# EasyEDA Pro project pad_2025-11-01.epro

# Schematic pad
Board Name: pad; Create Date: 2025-10-30; Page Name: Sheet_1; Project Name: Makro; Schematic Name: pad; Update Date: 2025-10-30; Add into BOM: yes; Convert to PCB: yes; Sheet: 1/1; spicePre: .
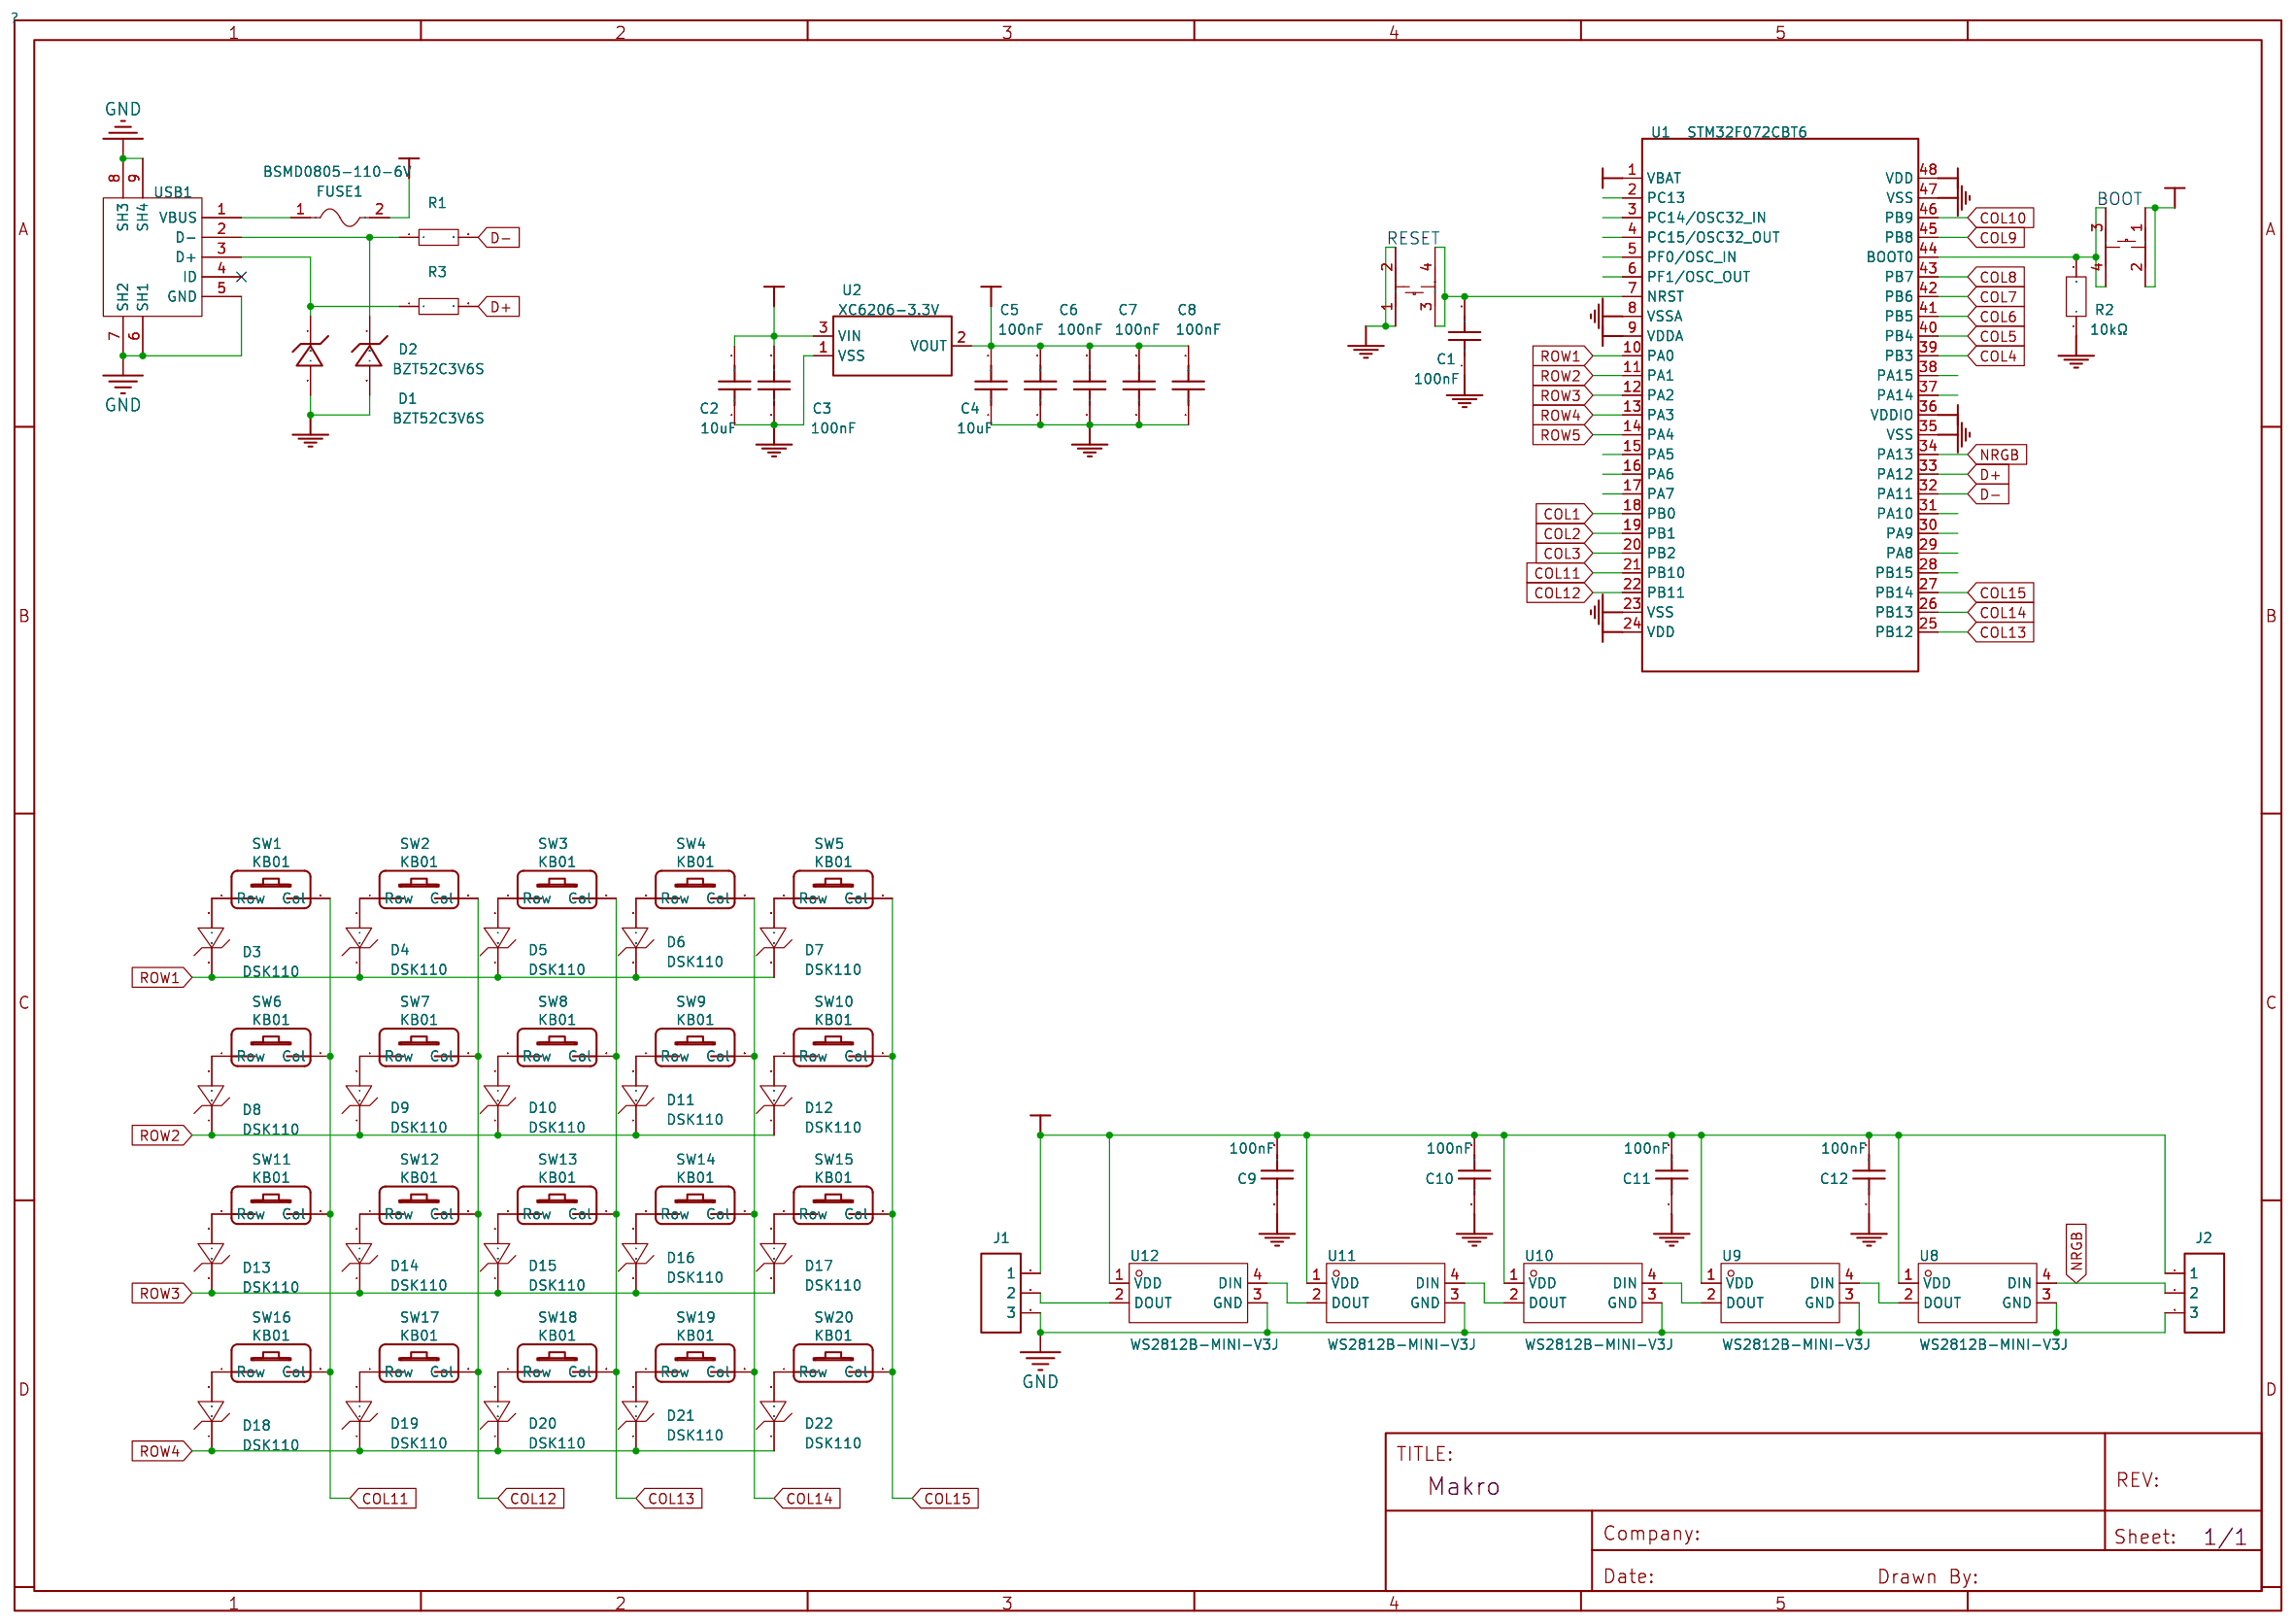
[diagram p0: schematic sheet]

## Parts
C1  100nF  [C0805]
C2  10uF  [C0805]
C3  100nF  [C0805]
C4  10uF  [C0805]
C5  100nF  [C0805]
C6  100nF  [C0805]
C7  100nF  [C0805]
C8  100nF  [C0805]
C9  100nF  [C0805]
C10  100nF  [C0805]
C11  100nF  [C0805]
C12  100nF  [C0805]
D1  BZT52C3V6S  [SOD-323_L1.7-W1.3-LS2.5-RD]
D2  BZT52C3V6S  [SOD-323_L1.7-W1.3-LS2.5-RD]
D3  DSK110  [SOD-123FL_L2.7-W1.8-LS3.8-RD]
D4  DSK110  [SOD-123FL_L2.7-W1.8-LS3.8-RD]
D5  DSK110  [SOD-123FL_L2.7-W1.8-LS3.8-RD]
D6  DSK110  [SOD-123FL_L2.7-W1.8-LS3.8-RD]
D7  DSK110  [SOD-123FL_L2.7-W1.8-LS3.8-RD]
D8  DSK110  [SOD-123FL_L2.7-W1.8-LS3.8-RD]
D9  DSK110  [SOD-123FL_L2.7-W1.8-LS3.8-RD]
D10  DSK110  [SOD-123FL_L2.7-W1.8-LS3.8-RD]
D11  DSK110  [SOD-123FL_L2.7-W1.8-LS3.8-RD]
D12  DSK110  [SOD-123FL_L2.7-W1.8-LS3.8-RD]
D13  DSK110  [SOD-123FL_L2.7-W1.8-LS3.8-RD]
D14  DSK110  [SOD-123FL_L2.7-W1.8-LS3.8-RD]
D15  DSK110  [SOD-123FL_L2.7-W1.8-LS3.8-RD]
D16  DSK110  [SOD-123FL_L2.7-W1.8-LS3.8-RD]
D17  DSK110  [SOD-123FL_L2.7-W1.8-LS3.8-RD]
D18  DSK110  [SOD-123FL_L2.7-W1.8-LS3.8-RD]
D19  DSK110  [SOD-123FL_L2.7-W1.8-LS3.8-RD]
D20  DSK110  [SOD-123FL_L2.7-W1.8-LS3.8-RD]
D21  DSK110  [SOD-123FL_L2.7-W1.8-LS3.8-RD]
D22  DSK110  [SOD-123FL_L2.7-W1.8-LS3.8-RD]
FUSE1  BSMD0805-110-6V  [F0805]
J1  77311-102-03LF  [HDR-TH_3P-P2.54-V-M-1]  (no BOM)
J2  77311-102-03LF  [HDR-TH_3P-P2.54-V-M-1]  (no BOM)
KEY1  TS-1187A-C-B-B  [SW-SMD_4P-L5.1-W5.1-P3.70-LS6.5-TL_H1.6]
KEY2  TS-1187A-C-B-B  [SW-SMD_4P-L5.1-W5.1-P3.70-LS6.5-TL_H1.6]
R1  22Ω  [R0805]
R2  10kΩ  [R0805]
R3  22Ω  [R0805]
SW1  KB01  [HSWAP_SCK]
SW2  KB01  [HSWAP_SCK]
SW3  KB01  [HSWAP_SCK]
SW4  KB01  [HSWAP_SCK]
SW5  KB01  [HSWAP_SCK]
SW6  KB01  [HSWAP_SCK]
SW7  KB01  [HSWAP_SCK]
SW8  KB01  [HSWAP_SCK]
SW9  KB01  [HSWAP_SCK]
SW10  KB01  [HSWAP_SCK]
SW11  KB01  [HSWAP_SCK]
SW12  KB01  [HSWAP_SCK]
SW13  KB01  [HSWAP_SCK]
SW14  KB01  [HSWAP_SCK]
SW15  KB01  [HSWAP_SCK]
SW16  KB01  [HSWAP_SCK]
SW17  KB01  [HSWAP_SCK]
SW18  KB01  [HSWAP_SCK]
SW19  KB01  [HSWAP_SCK]
SW20  KB01  [HSWAP_SCK]
U1  STM32F072CBT6  [LQFP-48_L7.0-W7.0-P0.50-LS9.0-BL]
U2  XC6206-3.3V  [SSOT-3_L2.9-W1.6-P0.95-LS2.8-BR]
U8  WS2812B-MINI-V3J  [LED-SMD_4P-L3.5-W3.5-P1.80-LS6.2_WS2812B-MINI-V3J]
U9  WS2812B-MINI-V3J  [LED-SMD_4P-L3.5-W3.5-P1.80-LS6.2_WS2812B-MINI-V3J]
U10  WS2812B-MINI-V3J  [LED-SMD_4P-L3.5-W3.5-P1.80-LS6.2_WS2812B-MINI-V3J]
U11  WS2812B-MINI-V3J  [LED-SMD_4P-L3.5-W3.5-P1.80-LS6.2_WS2812B-MINI-V3J]
U12  WS2812B-MINI-V3J  [LED-SMD_4P-L3.5-W3.5-P1.80-LS6.2_WS2812B-MINI-V3J]
USB1  MicroXNJ  [MICRO-USB-SMD_MICROXNJ]

## Library data of the parts
C1 C3 C5-C12 = CC0805KKX7R0BB104: Capacitance: Tolerance:±10% Tolerance:±10% Voltage Rated: Temperature Coefficient:; LCSC Part Name: 100nF ±10% 100V; Supplier Part: C106243; Manufacturer: YAGEO(国巨); Supplier Footprint: 0805; JLCPCB Part Class: Extended Part; Datasheet: https://atta.szlcsc.com/upload/public/pdf/source/20170505/1493951378248.pdf; Supplier: LCSC; Tolerance: ±10%
C2 C4 = CL21B106KQQNNNE: Capacitance:10uF Tolerance:±10% Tolerance:±10% Voltage Rating:6.3V Temperature Coefficient:X7R; LCSC Part Name: 10uF ±10% 6.3V; Supplier Part: C100083; Manufacturer: SAMSUNG(三星); Supplier Footprint: 0805; JLCPCB Part Class: Extended Part; Datasheet: https://item.szlcsc.com/datasheet/CL21B106KQQNNNE/101297.html; Supplier: LCSC; Tolerance: ±10%; Voltage Rating: 6.3V; Temperature Coefficient: X7R
D1 D2 = BZT52C3V6S_C2886313: Diode Configuration:Independent Zener Voltage(Nom):3.6V Reverse Leakage Current (Ir):5uA Zener Voltage(Range):3.4V~3.8V Zener Voltage(Range):3.4V~3.8V Pd - Power Dissipation:200mW Impedance(Zzt):90Ω Impedance(Zzk):600Ω; LCSC Part Name: 独立式 耐压:3.6V 电流:5uA; Supplier Part: C2886313; Manufacturer: CBI(创基); Supplier Footprint: SOD-323; JLCPCB Part Class: Extended Part; Datasheet: https://item.szlcsc.com/datasheet/BZT52C3V6S/3098594.html; Supplier: LCSC; Diode Configuration: Independent; Zener Voltage(Nom): 3.6V; Reverse Leakage Current (Ir): 5uA; Zener Voltage(Range): 3.4V~3.8V; Pd - Power Dissipation: 200mW; Impedance(Zzt): 90Ω; Impedance(Zzk): 600Ω
D3-D22 = DSK110_C41371069: Diode Configuration:Independent Voltage - Forward(Vf@If):850mV@1A Voltage - DC Reverse(Vr):100V Current - Rectified:1A Reverse Leakage Current (Ir):200uA Operating Junction Temperature Range:-65℃~+150℃ Operating Junction Temperature Range:-65℃~+150℃ Non-R; LCSC Part Name: 电压:100V 电流:1A; Supplier Part: C41371069; Manufacturer: GOODWORK(固得沃克); Supplier Footprint: SOD-123FL; JLCPCB Part Class: Extended Part; Datasheet: https://item.szlcsc.com/datasheet/DSK110/43131907.html; Supplier: LCSC; Diode Configuration: Independent; Voltage - Forward(Vf@If): 850mV@1A; Voltage - DC Reverse(Vr): 100V; Current - Rectified: 1A; Reverse Leakage Current (Ir): 200uA; Operating Junction Temperature Range: -65℃~+150℃; Non-Repetitive Peak Forward Surge Current: 30A
FUSE1 = BSMD0805-110-6V: Voltage - Max:6V Current - Max:40A Hold Current:1.1A Trip Current:2.2A Power Dissipation:600mW Resistance - Initial (Ri) (Min):35mΩ Resistance - Post Trip (R1) (Max):230mΩ Time to Trip(Max):- Operating Temperature:-40℃~+85℃ Operating Temperature:-40℃~+85℃; LCSC Part Name: 6V 1.1A 0805自恢复; Supplier Part: C883113; Manufacturer: BHFUSE(佰宏); Supplier Footprint: 0805; JLCPCB Part Class: Extended Part; Datasheet: https://item.szlcsc.com/datasheet/BSMD0805-110-6V/947788.html; Supplier: LCSC; Voltage - Max: 6V; Current - Max: 40A; Hold Current: 1.1A; Trip Current: 2.2A; Power Dissipation: 600mW; Resistance - Initial (Ri) (Min): 35mΩ; Resistance - Post Trip (R1) (Max): 230mΩ; Operating Temperature: -40℃~+85℃; Length: 2.2mm; Width: 1.5mm; Height: 1.2mm
J1 J2 = 77311-102-03LF: Pin Structure:- Pitch:2.54mm Row Spacing:- Circluar Pins/Square Pins:Pin Header Mounting Type:Through Hole Number of Rows:1 Number of Pins:3P Current Rating:3A Voltage Rating (Max):- Length of Mating Pin:- Insulation Height:2.54mm Contact Material:Phospho; LCSC Part Name: 间距:2.54mm 方针 直插; Supplier Part: C180248; Manufacturer: Amphenol; Supplier Footprint: 插件,P=2.54mm; JLCPCB Part Class: Extended Part; Datasheet: https://item.szlcsc.com/datasheet/77311-102-03LF/191643.html; Supplier: LCSC; Pitch: 2.54mm; Circluar Pins/Square Pins: Pin Header; Mounting Type: Through Hole; Number of Rows: 1; Number of Pins: 3P; Current Rating: 3A; Insulation Height: 2.54mm; Contact Material: Phosphor Bronze; Contact Plating: Tin; Operating Temperature: -65℃~+125℃; Color: Black
KEY1 KEY2 = TS-1187A-C-B-B: Circuit:SPST Actuator Style:Round Button Operating Force:260gf Mounting Style:Brick nogging Switch Length:5.1mm Switch Width:5.1mm Switch Height:1.6mm Strike Gundam:不带 Contact Current:50mA Voltage Rating (DC):12V Insulation Resistance:- Actuator/Cap Color; LCSC Part Name: 5.1*5.1*1.6mm 立贴 轻触开关; Supplier Part: C1121873; Manufacturer: XKB Connectivity(中国星坤); Supplier Footprint: SMD; JLCPCB Part Class: Extended Part; Datasheet: https://atta.szlcsc.com/upload/public/pdf/source/20211011/CF465E46D2427DB66E133733EF19F823.pdf; Supplier: LCSC; Circuit: SPST; Actuator Style: Round Button; Operating Force: 260gf; Mounting Style: Brick nogging; Switch Length: 5.1mm; Switch Width: 5.1mm; Switch Height: 1.6mm; Strike Gundam: 不带; Contact Current: 50mA; Voltage Rating (DC): 12V; Actuator/Cap Color: 金色; With Lamp: No; Mechanical Life: 10万次; Operating Temperature: -30℃~+85℃
R1 R3 = 0805W8F220JT5E: Type:Thick Film Resistor Resistance:22Ω Tolerance:±1% Tolerance:±1% Power(Watts):125mW Voltage-Supply(Max):150V Temperature Coefficient:±100ppm/℃ Temperature Coefficient:±100ppm/℃ Operating Temperature:-55℃~+155℃ Operating Temperature:-55℃~+155℃; LCSC Part Name: 22Ω ±1% 125mW 厚膜电阻; Supplier Part: C17561; Manufacturer: UNI-ROYAL(厚声); Supplier Footprint: 0805; JLCPCB Part Class: Basic Part; Datasheet: https://item.szlcsc.com/datasheet/0805W8F220JT5E/18249.html; Supplier: LCSC; Type: Thick Film Resistor; Tolerance: ±1%; Power(Watts): 125mW; Voltage-Supply(Max): 150V; Temperature Coefficient: ±100ppm/℃; Operating Temperature: -55℃~+155℃
R2 = FRC0805J103TS: Type:Thick Film Resistor Resistance:10kΩ Tolerance:±5% Tolerance:±5% Power(Watts):125mW Voltage-Supply(Max):150V Temperature Coefficient:±100ppm/℃ Temperature Coefficient:±100ppm/℃ Operating Temperature:-55℃~+155℃ Operating Temperature:-55℃~+155℃; LCSC Part Name: 10kΩ ±5% 125mW 厚膜电阻; Supplier Part: C2930231; Manufacturer: FOJAN(富捷); Supplier Footprint: 0805; JLCPCB Part Class: Extended Part; Supplier: LCSC; Type: Thick Film Resistor; Tolerance: ±5%; Power(Watts): 125mW; Voltage-Supply(Max): 150V; Temperature Coefficient: ±100ppm/℃; Operating Temperature: -55℃~+155℃
SW1-SW20 = KB01: Manufacturer: 00; Manufacturer Part: 00; Supplier Part: 00; Contributor: Citiclzy; spicePre: S; spiceSymbolName: 凯华矮轴
U1 = STM32F072CBT6: Supplier: LCSC; Manufacturer: ST(意法半导体); Supplier Part: C81720; JLCPCB Part Class: Extended Part; link: https://so.szlcsc.com/global.html?k=C81720&ref=editor; spicePre: U
U2 = XC6206-3.3V: Supplier: LCSC; Supplier Part: C2891841; Manufacturer: YONGYUTAI(永裕泰); JLCPCB Part Class: Extended Part; link: https://so.szlcsc.com/global.html?k=C2891841&ref=editor; Contributor: LCSC; spicePre: U
U8-U12 = WS2812B-MINI-V3J: LCSC Part Name: SMD灯珠,RGB三色; Supplier Part: C22371519; Manufacturer: worldsemi; Supplier Footprint: SMD-4P,3.5x3.5mm; JLCPCB Part Class: Extended Part; Datasheet: https://atta.szlcsc.com/upload/public/pdf/source/20240329/C020F34940C489E8E8DDFB82EA5988A4.pdf; Supplier: LCSC
USB1 = MicroXNJ: Connector Type:Micro-B Standard:USB 2.0 Gender:Female Mounting Style:Horizontal attachment Number of Contacts:5P Number of Ports:1 Current Rating - Power (Max):1.8A Operating Temperature Range:-20℃~+85℃ Operating Temperature Range:-20℃~+85℃ Rated Voltage; LCSC Part Name: Micro-B 母 卧贴; Supplier Part: C404969; Manufacturer: SHOU HAN(首韩); Supplier Footprint: SMD; JLCPCB Part Class: Extended Part; Datasheet: https://atta.szlcsc.com/upload/public/pdf/source/20220415/2494EDFF499AF6F852F7C820374B6AF3.pdf; Supplier: LCSC; Connector Type: Micro-B; Standard: USB 2.0; Gender: Female; Mounting Style: Horizontal attachment; Number of Contacts: 5P; Number of Ports: 1; Current Rating - Power (Max): 1.8A; Operating Temperature Range: -20℃~+85℃; Rated Voltage (Max): 30V; Connect-Disconnect Life: 5000 Cuts; Core Colour: Black

## Nets
+3.3V: C4.2 C5.2 C6.2 C7.2 C8.2 KEY1.1 KEY1.2 U1.1(VBAT) U1.9(VDDA) U1.24(VDD) U1.36(VDDIO) U1.48(VDD) U2.2(VOUT)
GND: C1.1 C2.1 C3.1 C4.1 C5.1 C6.1 C7.1 C8.1 C9.1 C10.1 C11.1 C12.1 D1.2(A) D2.2(A) J1.3 J2.3 KEY2.1 KEY2.2 R2.1 U1.8(VSSA) U1.23(VSS) U1.35(VSS) U1.47(VSS) U2.1(VSS) U8.3(GND) U9.3(GND) U10.3(GND) U11.3(GND) U12.3(GND) USB1.5(GND) USB1.6(SH1) USB1.7(SH2) USB1.8(SH3) USB1.9(SH4)
VCC: C2.2 C3.2 C9.2 C10.2 C11.2 C12.2 FUSE1.2 J1.1 J2.1 U2.3(VIN) U8.1(VDD) U9.1(VDD) U10.1(VDD) U11.1(VDD) U12.1(VDD)
COL1: U1.18(PB0)
COL2: U1.19(PB1)
COL3: U1.20(PB2)
COL4: U1.39(PB3)
COL5: U1.40(PB4)
COL6: U1.41(PB5)
COL7: U1.42(PB6)
COL8: U1.43(PB7)
COL9: U1.45(PB8)
COL10: U1.46(PB9)
COL11: SW1.2(Col) SW6.2(Col) SW11.2(Col) SW16.2(Col) U1.21(PB10)
COL12: SW2.2(Col) SW7.2(Col) SW12.2(Col) SW17.2(Col) U1.22(PB11)
COL13: SW3.2(Col) SW8.2(Col) SW13.2(Col) SW18.2(Col) U1.25(PB12)
COL14: SW4.2(Col) SW9.2(Col) SW14.2(Col) SW19.2(Col) U1.26(PB13)
COL15: SW5.2(Col) SW10.2(Col) SW15.2(Col) SW20.2(Col) U1.27(PB14)
D+: R3.2 U1.33(PA12)
D-: R1.2 U1.32(PA11)
NRGB: J2.2 U1.34(PA13) U8.4(DIN)
ROW1: D3.1(C) D4.1(C) D5.1(C) D6.1(C) D7.1(C) U1.10(PA0)
ROW2: D8.1(C) D9.1(C) D10.1(C) D11.1(C) D12.1(C) U1.11(PA1)
ROW3: D13.1(C) D14.1(C) D15.1(C) D16.1(C) D17.1(C) U1.12(PA2)
ROW4: D18.1(C) D19.1(C) D20.1(C) D21.1(C) D22.1(C) U1.13(PA3)
ROW5: U1.14(PA4)
$C1_2: C1.2 KEY2.3 KEY2.4 U1.7(NRST)
$D1_1: D1.1(C) R3.1 USB1.3(D+)
$D2_1: D2.1(C) R1.1 USB1.2(D-)
$D3_2: D3.2(A) SW1.1(Row)
$D4_2: D4.2(A) SW2.1(Row)
$D5_2: D5.2(A) SW3.1(Row)
$D6_2: D6.2(A) SW4.1(Row)
$D7_2: D7.2(A) SW5.1(Row)
$D8_2: D8.2(A) SW6.1(Row)
$D9_2: D9.2(A) SW7.1(Row)
$D10_2: D10.2(A) SW8.1(Row)
$D11_2: D11.2(A) SW9.1(Row)
$D12_2: D12.2(A) SW10.1(Row)
$D13_2: D13.2(A) SW11.1(Row)
$D14_2: D14.2(A) SW12.1(Row)
$D15_2: D15.2(A) SW13.1(Row)
$D16_2: D16.2(A) SW14.1(Row)
$D17_2: D17.2(A) SW15.1(Row)
$D18_2: D18.2(A) SW16.1(Row)
$D19_2: D19.2(A) SW17.1(Row)
$D20_2: D20.2(A) SW18.1(Row)
$D21_2: D21.2(A) SW19.1(Row)
$D22_2: D22.2(A) SW20.1(Row)
$FUSE1_1: FUSE1.1 USB1.1(VBUS)
$J1_2: J1.2 U12.2(DOUT)
$KEY1_3: KEY1.3 KEY1.4 R2.2 U1.44(BOOT0)
$U8_2: U8.2(DOUT) U9.4(DIN)
$U10_2: U10.2(DOUT) U11.4(DIN)
$U10_4: U9.2(DOUT) U10.4(DIN)
$U11_2: U11.2(DOUT) U12.4(DIN)

Not connected (* = marked no-connect by the designer): U1 2(PC13) 3(PC14/OSC32_IN) 4(PC15/OSC32_OUT) 5(PF0/OSC_IN) 6(PF1/OSC_OUT) 15(PA5) 16(PA6) 17(PA7) 28(PB15) 29(PA8) 30(PA9) 31(PA10) 37(PA14) 38(PA15); USB1 4(ID)*

## Notes on the sheet
- BOOT
- RESET

# Board pad
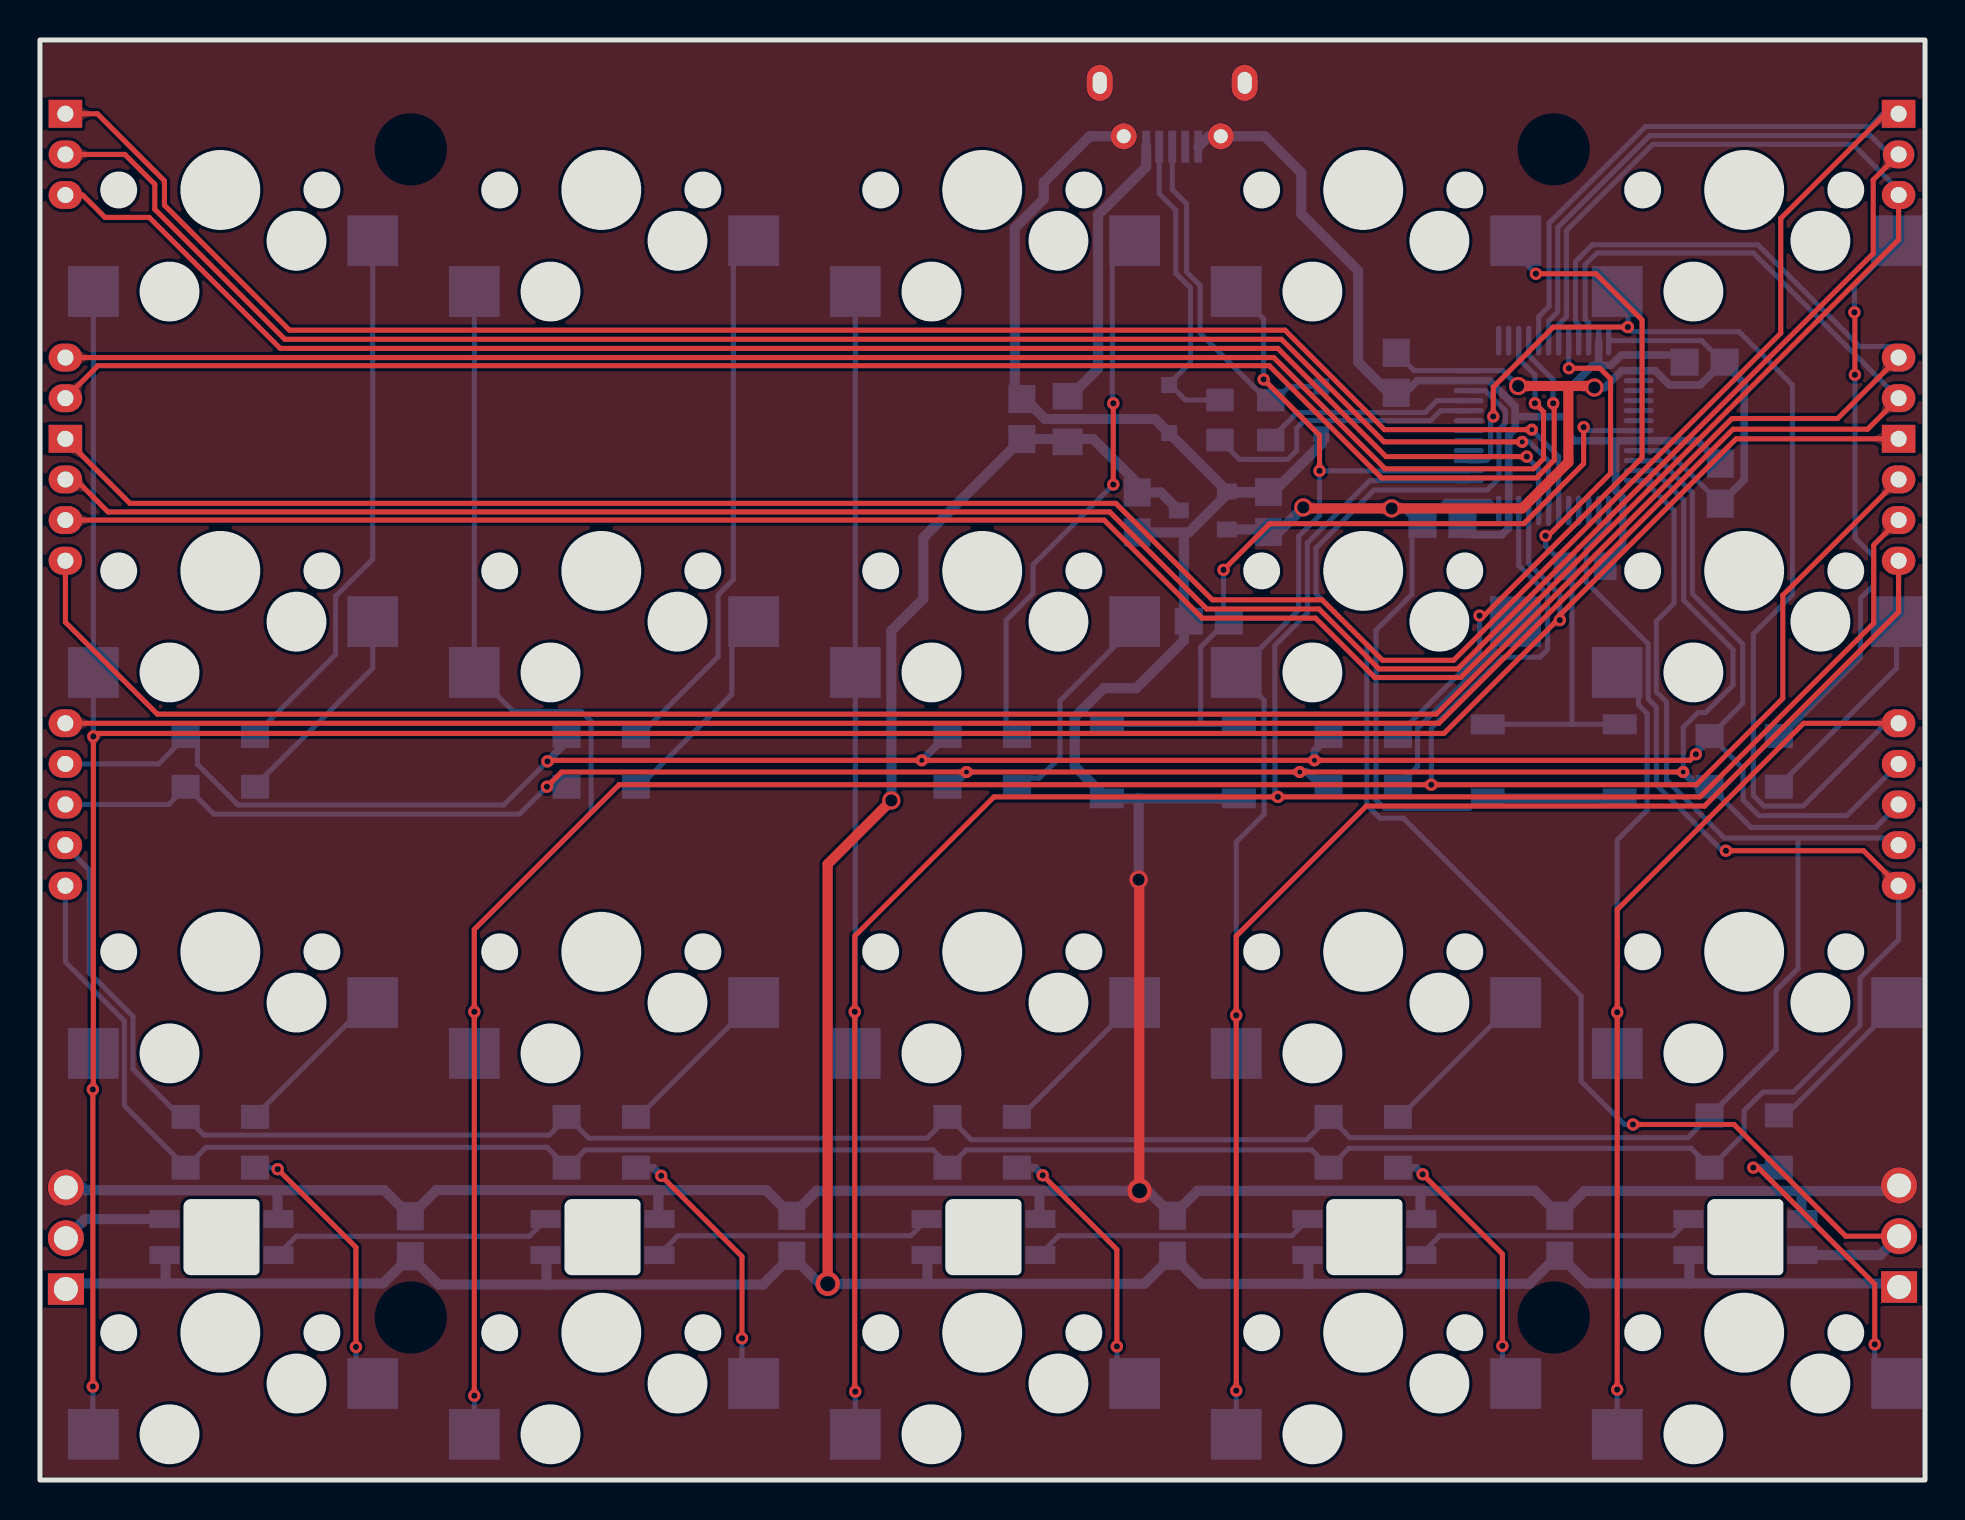
[diagram p1: board, top side]
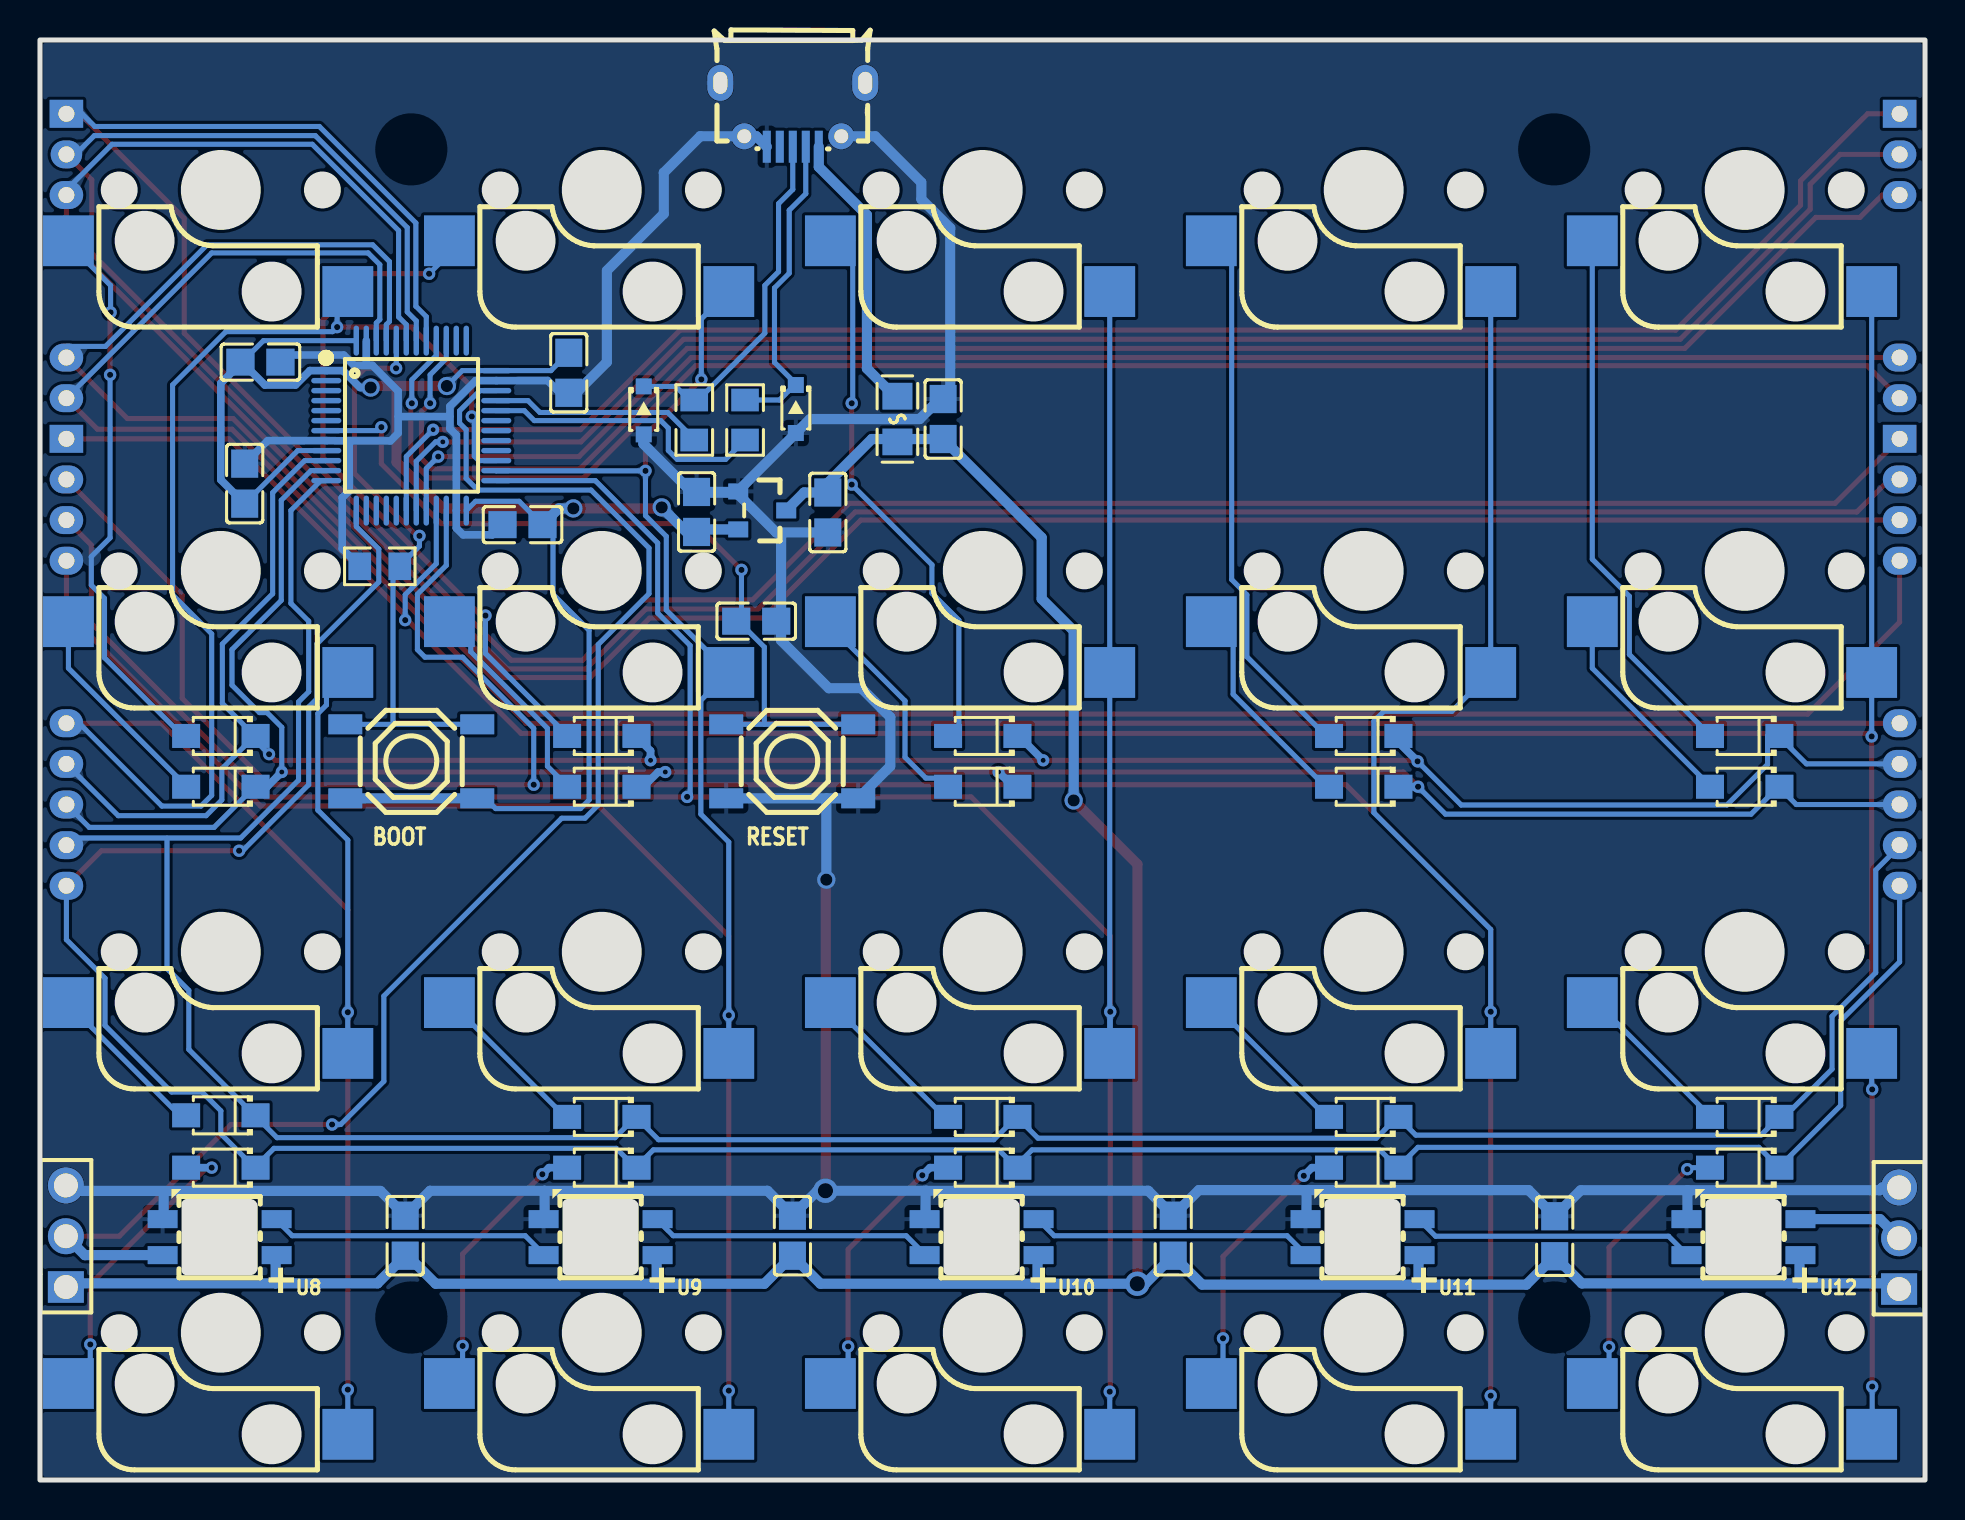
[diagram p2: board, bottom side, seen from below]

Outline 94.26 x 72.02 mm; copper layers: Top Layer, Bottom Layer. Coordinates in mm from the lower left corner of the outline.
Outline path: rectangle 0,72.02 94.26,0
Stack: Top Layer 0.035mm / Dielectric1 1.51mm FR4 er 4.5 / Bottom Layer 0.035mm

## Design rules (mm)
spacing Default (default): track to track 0.152, other pairs 0 to 0.152
spacing Vcc: track to track 0.152, other pairs 0 to 0.152
track width Default (default): min 0.254, default 0.254, max 25.4
track width Vcc: min 0.381, default 0.381, max 25.4
differential pair differentialPair (default): width min 0.127, default 0.254, max 2.54; gap min 0.152, default 0.152
via Default (default): diameter min 0.61, default 0.61, max 100.025; hole min 0.254, default 0.254, max 59.995
via Vcc: diameter min 0.762, default 0.762, max 100.025; hole min 0.381, default 0.381, max 59.995
net VCC uses Vcc

## Placement (name value [footprint] x y rotation side)
C1  100nF  [C0805]  58.45 42.95 0 bottom
C2  10uF  [C0805]  49.1 53.06 270 bottom
C3  100nF  [C0805]  54.86 48.39 90 bottom
C4  10uF  [C0805]  61.43 48.41 270 bottom
C5  100nF  [C0805]  83.24 55.91 0 bottom
C6  100nF  [C0805]  70.13 47.78 180 bottom
C7  100nF  [C0805]  67.82 55.37 90 bottom
C8  100nF  [C0805]  84.02 49.83 270 bottom
C9  100nF  [C0805]  18.52 12.19 270 bottom
C10  100nF  [C0805]  56.63 12.22 270 bottom
C11  100nF  [C0805]  37.59 12.22 270 bottom
C12  100nF  [C0805]  76 12.22 270 bottom
D1  BZT52C3V6S  [SOD-323_L1.7-W1.3-LS2.5-RD]  64.07 53.49 270 bottom
D2  BZT52C3V6S  [SOD-323_L1.7-W1.3-LS2.5-RD]  56.46 53.56 270 bottom
D3  DSK110  [SOD-123FL_L2.7-W1.8-LS3.8-RD]  9.02 37.21 0 bottom
D4  DSK110  [SOD-123FL_L2.7-W1.8-LS3.8-RD]  28.07 37.21 0 bottom
D5  DSK110  [SOD-123FL_L2.7-W1.8-LS3.8-RD]  47.12 37.21 0 bottom
D6  DSK110  [SOD-123FL_L2.7-W1.8-LS3.8-RD]  66.17 37.21 0 bottom
D7  DSK110  [SOD-123FL_L2.7-W1.8-LS3.8-RD]  85.22 37.21 0 bottom
D8  DSK110  [SOD-123FL_L2.7-W1.8-LS3.8-RD]  9.02 34.67 0 bottom
D9  DSK110  [SOD-123FL_L2.7-W1.8-LS3.8-RD]  28.07 34.67 0 bottom
D10  DSK110  [SOD-123FL_L2.7-W1.8-LS3.8-RD]  47.12 34.67 0 bottom
D11  DSK110  [SOD-123FL_L2.7-W1.8-LS3.8-RD]  66.17 34.67 0 bottom
D12  DSK110  [SOD-123FL_L2.7-W1.8-LS3.8-RD]  85.22 34.67 0 bottom
D13  DSK110  [SOD-123FL_L2.7-W1.8-LS3.8-RD]  9.02 18.16 0 bottom
D14  DSK110  [SOD-123FL_L2.7-W1.8-LS3.8-RD]  28.07 18.16 0 bottom
D15  DSK110  [SOD-123FL_L2.7-W1.8-LS3.8-RD]  47.12 18.16 0 bottom
D16  DSK110  [SOD-123FL_L2.7-W1.8-LS3.8-RD]  66.17 18.16 0 bottom
D17  DSK110  [SOD-123FL_L2.7-W1.8-LS3.8-RD]  85.22 18.24 0 bottom
D18  DSK110  [SOD-123FL_L2.7-W1.8-LS3.8-RD]  9.02 15.62 0 bottom
D19  DSK110  [SOD-123FL_L2.7-W1.8-LS3.8-RD]  28.07 15.62 0 bottom
D20  DSK110  [SOD-123FL_L2.7-W1.8-LS3.8-RD]  47.12 15.62 0 bottom
D21  DSK110  [SOD-123FL_L2.7-W1.8-LS3.8-RD]  66.17 15.62 0 bottom
D22  DSK110  [SOD-123FL_L2.7-W1.8-LS3.8-RD]  85.22 15.62 0 bottom
FUSE1  BSMD0805-110-6V  [F0805]  51.38 53.06 270 bottom
J1  77311-102-03LF  [HDR-TH_3P-P2.54-V-M-1]  1.3 12.09 90 bottom
J2  77311-102-03LF  [HDR-TH_3P-P2.54-V-M-1]  92.96 12.19 90 bottom
KEY1  TS-1187A-C-B-B  [SW-SMD_4P-L5.1-W5.1-P3.70-LS6.5-TL_H1.6]  75.69 35.94 0 bottom
KEY2  TS-1187A-C-B-B  [SW-SMD_4P-L5.1-W5.1-P3.70-LS6.5-TL_H1.6]  56.64 35.94 0 bottom
NOREF  -  [Pad_e2123]  92.94 45.97 0 top
NOREF#2  -  [Pad_e2092]  92.94 68.33 0 top
NOREF#3  -  [Pad_e2111]  1.27 56.13 0 top
NOREF#4  -  [Pad_e2117]  1.27 48.01 0 top
NOREF#5  -  [Pad_e2112]  1.27 45.97 0 top
NOREF#6  -  [Pad_e2099]  92.94 31.75 0 top
NOREF#7  -  [Pad_e2114]  1.27 54.1 0 top
NOREF#8  -  [Pad_e2118]  1.27 35.81 0 top
NOREF#9  -  [Pad_e2115]  1.27 52.07 0 top
NOREF#10  -  [Pad_e2093]  92.94 52.07 0 top
NOREF#11  -  [Pad_e2113]  1.27 37.85 0 top
NOREF#12  -  [Pad_e2101]  92.94 35.81 0 top
NOREF#13  -  [Pad_e2097]  92.94 50.04 0 top
NOREF#14  -  [Pad_e2100]  92.94 33.78 0 top
NOREF#15  -  [Pad_e2091]  92.94 66.29 0 top
NOREF#16  -  [Pad_e2095]  92.94 56.13 0 top
NOREF#17  -  [Pad_e2116]  1.27 50.04 0 top
NOREF#18  -  [Pad_e2098]  92.94 29.72 0 top
NOREF#19  -  [Pad_e2119]  1.27 33.78 0 top
NOREF#20  -  [Pad_e2109]  1.27 66.29 0 top
NOREF#21  -  [Pad_e2108]  1.27 68.33 0 top
NOREF#22  -  [Pad_e2096]  92.94 37.85 0 top
NOREF#23  -  [Pad_e2090]  92.94 64.26 0 top
NOREF#24  -  [Pad_e2120]  1.27 31.75 0 top
NOREF#25  -  [Pad_e2122]  92.94 48.01 0 top
NOREF#26  -  [Pad_e2110]  1.27 64.26 0 top
NOREF#27  -  [Pad_e2094]  92.94 54.1 0 top
NOREF#28  -  [Pad_e2121]  1.27 29.72 0 top
R1  22Ω  [R0805]  59 53.01 270 bottom
R2  10kΩ  [R0805]  77.27 45.69 180 bottom
R3  22Ω  [R0805]  61.54 53.01 270 bottom
SW1  KB01  [HSWAP_SCK]  9.02 64.52 180 bottom
SW2  KB01  [HSWAP_SCK]  28.07 64.52 180 bottom
SW3  KB01  [HSWAP_SCK]  47.12 64.52 180 bottom
SW4  KB01  [HSWAP_SCK]  66.17 64.52 180 bottom
SW5  KB01  [HSWAP_SCK]  85.22 64.52 180 bottom
SW6  KB01  [HSWAP_SCK]  9.02 45.47 180 bottom
SW7  KB01  [HSWAP_SCK]  28.07 45.47 180 bottom
SW8  KB01  [HSWAP_SCK]  47.12 45.47 180 bottom
SW9  KB01  [HSWAP_SCK]  66.17 45.47 180 bottom
SW10  KB01  [HSWAP_SCK]  85.22 45.47 180 bottom
SW11  KB01  [HSWAP_SCK]  9.02 26.42 180 bottom
SW12  KB01  [HSWAP_SCK]  28.07 26.42 180 bottom
SW13  KB01  [HSWAP_SCK]  47.12 26.42 180 bottom
SW14  KB01  [HSWAP_SCK]  66.17 26.42 180 bottom
SW15  KB01  [HSWAP_SCK]  85.22 26.42 180 bottom
SW16  KB01  [HSWAP_SCK]  9.02 7.37 180 bottom
SW17  KB01  [HSWAP_SCK]  28.07 7.37 180 bottom
SW18  KB01  [HSWAP_SCK]  47.12 7.37 180 bottom
SW19  KB01  [HSWAP_SCK]  66.17 7.37 180 bottom
SW20  KB01  [HSWAP_SCK]  85.22 7.37 180 bottom
U1  STM32F072CBT6  [LQFP-48_L7.0-W7.0-P0.50-LS9.0-BL]  75.69 52.73 270 bottom
U2  XC6206-3.3V  [SSOT-3_L2.9-W1.6-P0.95-LS2.8-BR]  58.14 48.49 0 bottom
U8  WS2812B-MINI-V3J  [LED-SMD_4P-L3.5-W3.5-P1.80-LS6.2_WS2812B-MINI-V3J]  85.28 12.15 0 bottom
U9  WS2812B-MINI-V3J  [LED-SMD_4P-L3.5-W3.5-P1.80-LS6.2_WS2812B-MINI-V3J]  66.23 12.15 0 bottom
U10  WS2812B-MINI-V3J  [LED-SMD_4P-L3.5-W3.5-P1.80-LS6.2_WS2812B-MINI-V3J]  47.18 12.15 0 bottom
U11  WS2812B-MINI-V3J  [LED-SMD_4P-L3.5-W3.5-P1.80-LS6.2_WS2812B-MINI-V3J]  28.13 12.15 0 bottom
U12  WS2812B-MINI-V3J  [LED-SMD_4P-L3.5-W3.5-P1.80-LS6.2_WS2812B-MINI-V3J]  9.08 12.15 0 bottom
USB1  MicroXNJ  [MICRO-USB-SMD_MICROXNJ]  56.62 68.28 0 bottom

## Footprints (pads in the part's own frame, mm; a bottom-side part is the same pattern mirrored in y, then rotated)
C0805
  rect 1.41x1.35 smd: 1(-1,0) 2(1,0)
F0805
  rect 1.335x1.5 smd: 1(-1.143,0) 2(1.143,0)
HDR-TH_3P-P2.54-V-M-1
  rect 1.575x1.8 hole 1.2: 1(-2.54,0)
  round 1.8 hole 1.2: 2(0,0) 3(2.54,0)
HSWAP_SCK
  rect 2.54x2.54 smd: 1(-7.62,-2.54) 2(6.35,-5.08)
LED-SMD_4P-L3.5-W3.5-P1.80-LS6.2_WS2812B-MINI-V3J
  rect 1.5x0.9 smd: 1(-2.85,0.9) 2(-2.85,-0.9) 3(2.85,-0.9) 4(2.85,0.9)
LQFP-48_L7.0-W7.0-P0.50-LS9.0-BL
  oval 0.27x1.5 smd: 1(-2.75,-4.25) 2(-2.25,-4.25) 3(-1.75,-4.25) 4(-1.25,-4.25) 5(-0.75,-4.25) 6(-0.25,-4.25) 7(0.25,-4.25) 8(0.75,-4.25) 9(1.25,-4.25) 10(1.75,-4.25) 11(2.25,-4.25) 12(2.75,-4.25) 25(2.75,4.25) 26(2.25,4.25) 27(1.75,4.25) 28(1.25,4.25) 29(0.75,4.25) 30(0.25,4.25) 31(-0.25,4.25) 32(-0.75,4.25) 33(-1.25,4.25) 34(-1.75,4.25) 35(-2.25,4.25) 36(-2.75,4.25)
  oval 1.5x0.27 smd: 13(4.25,-2.75) 14(4.25,-2.25) 15(4.25,-1.75) 16(4.25,-1.25) 17(4.25,-0.75) 18(4.25,-0.25) 19(4.25,0.25) 20(4.25,0.75) 21(4.25,1.25) 22(4.25,1.75) 23(4.25,2.25) 24(4.25,2.75) 37(-4.25,2.75) 38(-4.25,2.25) 39(-4.25,1.75) 40(-4.25,1.25) 41(-4.25,0.75) 42(-4.25,0.25) 43(-4.25,-0.25) 44(-4.25,-0.75) 45(-4.25,-1.25) 46(-4.25,-1.75) 47(-4.25,-2.25) 48(-4.25,-2.75)
MICRO-USB-SMD_MICROXNJ
  rect 0.4x1.6 smd: 1(-1.3,1.597) 2(-0.65,1.597) 3(0,1.597) 4(0.65,1.597) 5(1.3,1.597)
  round 1.3 hole 0.7: 6(2.425,1.074) 9(-2.425,1.073)
  oval 1.3x1.8 hole 0.7x1.1: 7(3.625,-1.597) 8(-3.625,-1.597)
Pad_e2090
  oval 1.677x1.397 hole 0.8: 4(0,0)
Pad_e2091
  oval 1.575x1.397 hole 0.8: 3(0,0)
Pad_e2092
  rect 1.677x1.397 hole 0.8: 2(0,0)
Pad_e2093
  rect 1.677x1.397 hole 0.8: 3(0,0)
Pad_e2094
  oval 1.677x1.397 hole 0.8: 2(0,0)
Pad_e2095
  oval 1.677x1.397 hole 0.8: 1(0,0)
Pad_e2096
  oval 1.677x1.397 hole 0.8: 2(0,0)
Pad_e2097
  oval 1.677x1.397 hole 0.8: 1(0,0)
Pad_e2098
  oval 1.677x1.397 hole 0.8: 4(0,0)
Pad_e2099
  oval 1.677x1.397 hole 0.8: 3(0,0)
Pad_e2100
  oval 1.677x1.397 hole 0.8: 2(0,0)
Pad_e2101
  oval 1.677x1.397 hole 0.8: 1(0,0)
Pad_e2108
  rect 1.677x1.397 hole 0.8: 1(0,0)
Pad_e2109
  oval 1.677x1.397 hole 0.8: 2(0,0)
Pad_e2110
  oval 1.677x1.397 hole 0.8: 3(0,0)
Pad_e2111
  oval 1.677x1.397 hole 0.8: 4(0,0)
Pad_e2112
  oval 1.677x1.397 hole 0.8: 1(0,0)
Pad_e2113
  oval 1.677x1.397 hole 0.8: 2(0,0)
Pad_e2114
  oval 1.677x1.397 hole 0.8: 1(0,0)
Pad_e2115
  rect 1.677x1.397 hole 0.8: 2(0,0)
Pad_e2116
  oval 1.677x1.397 hole 0.8: 3(0,0)
Pad_e2117
  oval 1.677x1.397 hole 0.8: 4(0,0)
Pad_e2118
  oval 1.677x1.397 hole 0.8: 1(0,0)
Pad_e2119
  oval 1.677x1.397 hole 0.8: 2(0,0)
Pad_e2120
  oval 1.677x1.397 hole 0.8: 3(0,0)
Pad_e2121
  oval 1.677x1.397 hole 0.8: 4(0,0)
Pad_e2122
  oval 1.677x1.397 hole 0.8: 2(0,0)
Pad_e2123
  oval 1.677x1.397 hole 0.8: 3(0,0)
R0805
  rect 1.133x1.377 smd: 1(-1,0) 2(1,0)
SOD-123FL_L2.7-W1.8-LS3.8-RD
  rect 1.4x1.2 smd: 1(-1.735,0) 2(1.735,0)
SOD-323_L1.7-W1.3-LS2.5-RD
  rect 0.8x0.8 smd: 1(-1.2,0) 2(1.2,0)
SSOT-3_L2.9-W1.6-P0.95-LS2.8-BR
  rect 1x0.8 smd: 1(1.2,-0.95) 2(1.2,0.95) 3(-1.2,0)
SW-SMD_4P-L5.1-W5.1-P3.70-LS6.5-TL_H1.6
  rect 1.7x1 smd: 1(-3.3,1.85) 2(3.3,1.85) 3(-3.3,-1.85) 4(3.3,-1.85)

## Nets
+3.3V: C4.2 C5.2 C6.2 C7.2 C8.2 KEY1.1 KEY1.2 U1.1 U1.9 U1.24 U1.36 U1.48 U2.2
GND: C1.1 C2.1 C3.1 C4.1 C5.1 C6.1 C7.1 C8.1 C9.1 C10.1 C11.1 C12.1 D1.2 D2.2 J1.3 J2.3 KEY2.1 KEY2.2 R2.1 U1.8 U1.23 U1.35 U1.47 U2.1 U8.3 U9.3 U10.3 U11.3 U12.3 USB1.5 USB1.6 USB1.7 USB1.8 USB1.9
VCC: C2.2 C3.2 C9.2 C10.2 C11.2 C12.2 FUSE1.2 J1.1 J2.1 U2.3 U8.1 U9.1 U10.1 U11.1 U12.1
$C1_2: C1.2 KEY2.3 KEY2.4 U1.7
$D1_1: D1.1 R3.1 USB1.3
$D2_1: D2.1 R1.1 USB1.2
$D3_2: D3.2 SW1.1
$D4_2: D4.2 SW2.1
$D5_2: D5.2 SW3.1
$D6_2: D6.2 SW4.1
$D7_2: D7.2 SW5.1
$D8_2: D8.2 SW6.1
$D9_2: D9.2 SW7.1
$D10_2: D10.2 SW8.1
$D11_2: D11.2 SW9.1
$D12_2: D12.2 SW10.1
$D13_2: D13.2 SW11.1
$D14_2: D14.2 SW12.1
$D15_2: D15.2 SW13.1
$D16_2: D16.2 SW14.1
$D17_2: D17.2 SW15.1
$D18_2: D18.2 SW16.1
$D19_2: D19.2 SW17.1
$D20_2: D20.2 SW18.1
$D21_2: D21.2 SW19.1
$D22_2: D22.2 SW20.1
$FUSE1_1: FUSE1.1 USB1.1
$J1_2: J1.2 U12.2
$KEY1_3: KEY1.3 KEY1.4 R2.2 U1.44
$U1_2: U1.2
$U1_3: U1.3
$U1_4: U1.4
$U1_5: U1.5
$U1_6: U1.6
$U1_15: U1.15
$U1_16: U1.16
$U1_17: U1.17
$U1_28: U1.28
$U1_29: U1.29
$U1_30: U1.30
$U1_31: U1.31
$U1_37: U1.37
$U1_38: U1.38
$U8_2: U8.2 U9.4
$U10_2: U10.2 U11.4
$U10_4: U9.2 U10.4
$U11_2: U11.2 U12.4
COL1: NOREF#21.1 U1.18
COL2: NOREF#20.2 U1.19
COL3: NOREF#26.3 U1.20
COL4: NOREF#3.4 U1.39
COL5: NOREF#7.1 U1.40
COL6: NOREF#2.2 NOREF#9.2 U1.41
COL7: NOREF#15.3 NOREF#17.3 U1.42
COL8: NOREF#4.4 NOREF#23.4 U1.43
COL9: NOREF#5.1 NOREF#16.1 U1.45
COL10: NOREF#11.2 NOREF#27.2 U1.46
COL11: NOREF#10.3 SW1.2 SW6.2 SW11.2 SW16.2 U1.21
COL12: NOREF#13.1 SW2.2 SW7.2 SW12.2 SW17.2 U1.22
COL13: NOREF#25.2 SW3.2 SW8.2 SW13.2 SW18.2 U1.25
COL14: NOREF.3 SW4.2 SW9.2 SW14.2 SW19.2 U1.26
COL15: NOREF#22.2 SW5.2 SW10.2 SW15.2 SW20.2 U1.27
D+: R3.2 U1.33
D-: R1.2 U1.32
NRGB: J2.2 U1.34 U8.4
ROW1: D3.1 D4.1 D5.1 D6.1 D7.1 NOREF#8.1 NOREF#12.1 U1.10
ROW2: D8.1 D9.1 D10.1 D11.1 D12.1 NOREF#14.2 NOREF#19.2 U1.11
ROW3: D13.1 D14.1 D15.1 D16.1 D17.1 NOREF#6.3 NOREF#24.3 U1.12
ROW4: D18.1 D19.1 D20.1 D21.1 D22.1 NOREF#18.4 NOREF#28.4 U1.13
ROW5: U1.14

Pads without a net: USB1 4

## Via types
v1: diameter 0.914, hole 0.61, Top Layer to Bottom Layer, 6 vias
v2: diameter 1.22, hole 0.762, Top Layer to Bottom Layer, 2 vias
v3: diameter 0.62, hole 0.31, Top Layer to Bottom Layer, 45 vias
v4: diameter 0.61, hole 0.254, Top Layer to Bottom Layer, 7 vias
v5: diameter 0.61, hole 0.305, Top Layer to Bottom Layer, 1 via

## Routing (per net, layer and track width the routed paths; a pad name or vN(x,y) marks a point on that pad's centre or on a via; arc(x,y) is an arc through that point)
+3.3V: length 94.2
  Top Layer w0.508: v1(77.72,54.64) 77.65,54.71 76.43,54.71 76.43,50.9 74.12,48.59 v1(67.59,48.59) 63.17,48.59 v1(63.17,48.64) ; v1(73.91,54.71) 76.45,54.71
  Bottom Layer w0.254: U1.9 81.37,51.48 C8.2 ; 78.44,56.98 83.09,56.98 84.16,55.91 ; C7.2 68.71,55.48 73.14,55.48 v1(73.91,54.71) ; 72.94,48.48 72.48,48.95 70.3,48.95 C6.2 68.61,47.78 68.61,44.3 66.8,42.49 66.8,34.01 67.23,33.58 71.48,33.58 71.99,34.09 KEY1.1
  Bottom Layer w0.381: v1(77.72,54.64) 78.26,54.64 79.1,55.48 80.76,55.48 81.48,54.76 83.02,54.76 84.16,55.91 85.22,54.85 85.22,50.02 C8.2
  Bottom Layer w0.508: 78.99,34.09 KEY1.1 ; U2.2 61.3,47.54 C4.2 ; v1(63.17,48.64) 61.56,47.03 61.43,47.03 ; C6.2 68.32,48.59 v1(67.59,48.59)
GND: length 251.5
  Top Layer w0.508: v2(54.98,14.47) 54.97,14.48 54.97,30 v1(54.94,30.02)
  Bottom Layer w0.381: 77.94,55.74 77.64,55.74 76.35,54.46 76.35,52.35 76.73,51.97 78.79,51.97 ; 77.94,55.74 78.55,55.74 79.07,56.26 81.8,56.26 82.16,55.91 ; 77.94,55.74 77.94,56.98 ; R2.1 79.15,46.57 79.15,49.12 78.79,49.48 78.79,51.97 ; 73.76,53.18 76.35,53.18 ; 84.02,50.83 82.87,51.98 79.94,51.98 78.79,51.97 ; 67.82,54.37 68.27,54.37 68.87,54.98 72.48,54.98 73.76,53.7 73.76,52.58 73.44,52.26 73.44,47.61 73.1,47.27 71.64,47.27 C6.1
  Bottom Layer w0.508: 49.98,13.05 49.98,14.47 ; 49.98,14.47 55.39,14.47 C10.1 57.88,14.46 69.03,14.46 ; 49.98,14.47 38.84,14.47 C11.1 36.31,14.5 30.93,14.5 ; 92.96,14.73 92.69,14.46 88.08,14.46 ; 11.88,14.49 17.22,14.49 C9.1 19.82,14.5 30.93,14.5 ; 11.88,14.49 2.27,14.49 2.13,14.63 J1.3 ; 11.88,14.49 11.88,13.05 ; 61.43,49.41 59.47,49.41 59.44,49.38 ; 88.08,14.46 77.24,14.46 C12.1 74.75,14.46 69.03,14.46 ; 88.08,14.46 88.08,13.05 ; 30.93,13.05 30.93,14.5 ; 57.2,47.39 57.44,47.39 59.44,49.38 ; 57.2,47.39 57.2,41.99 54.81,39.6 53.19,39.6 51.74,38.15 51.74,35.7 KEY2.1 54.94,34.09 ; 57.2,47.39 C3.1 ; 59.44,49.38 61.65,49.38 64.08,51.82 64.08,52.28 D1.2 ; 59.44,49.38 55.75,53.06 50.27,53.06 48.74,54.58 48.74,62.61 50.19,64.06 50.19,64.9 52.5,67.2 USB1.9 ; v1(54.94,30.02) 54.94,34.09 ; 54.94,34.09 59.94,34.09 ; 69.03,13.05 69.03,14.46 ; 67.82,54.37 67.45,54.37 65.91,55.91 65.91,60.48 63.07,63.32 63.07,65.38 61.25,67.2 58.44,67.2 USB1.5
VCC: length 159.5
  Top Layer w0.508: v1(42.57,33.99) 39.38,30.8 39.38,9.82 v2(39.39,9.82)
  Bottom Layer w0.508: 25.33,9.77 19.94,9.77 C9.2 17.16,9.83 6.28,9.83 ; 25.33,9.77 25.33,11.25 ; 25.33,9.77 36.15,9.77 C11.2 38.99,9.82 44.38,9.82 ; 44.38,9.82 55.23,9.82 C10.2 58.04,9.82 63.43,9.82 ; 44.38,9.82 44.38,11.25 ; 82.48,11.25 82.48,9.84 ; 82.48,9.84 92.78,9.84 J2.1 ; 82.48,9.84 77.38,9.84 C12.2 75.87,11.22 74.47,9.82 63.43,9.82 ; 6.28,9.83 1.58,9.83 J1.1 ; 6.28,9.83 6.28,11.25 ; U2.3 56.05,49.39 54.86,49.39 54.86,49.86 52.66,52.06 C2.2 44.17,47.13 44.17,44.07 42.57,42.47 v1(42.57,33.99) ; 63.43,11.25 63.43,9.82
$C1_2: length 39.7
  Top Layer w0.254: v3(59.18,45.52) 61.49,47.83 74.19,47.83 77.19,50.83 v3(77.19,52.65)
  Bottom Layer w0.254: v3(59.18,45.52) 59.18,42.8 58.04,41.66 58.04,37.79 ; 79.94,52.48 77.36,52.48 v3(77.19,52.65) ; 58.04,37.79 53.34,37.79 ; 58.04,37.79 59.94,37.79
$D1_1: length 17.6
  Bottom Layer w0.254: D1.1 62.47,54.69 61.79,54.01 61.36,54.01 58.01,57.35 58.01,59.74 57.33,60.43 57.33,63.83 56.62,64.54 USB1.3
$D2_1: length 15.7
  Bottom Layer w0.254: USB1.2 55.97,64.33 56.79,63.5 56.79,60.35 57.53,59.61 57.53,55.89 56.64,55 56.64,54.64 57.28,54.01 R1.1
$D3_2: length 27.2
  Bottom Layer w0.254: 10.71,37.21 14.78,41.29 14.78,44.2 16.64,46.05 SW1.1
$D4_2: length 27.9
  Bottom Layer w0.254: 29.76,37.21 29.95,37.21 33.91,41.17 33.91,44.27 34.67,45.03 34.67,61.98 SW2.1
$D5_2: length 28.6
  Top Layer w0.254: v3(53.67,49.78) v3(53.67,53.85)
  Bottom Layer w0.254: SW3.1 53.62,61.98 53.62,53.85 v3(53.67,53.85) ; 48.81,37.21 48.31,37.21 48.31,43 49.66,44.35 49.66,45.77 v3(53.67,49.78)
$D6_2: length 34.3
  Top Layer w0.254: v3(71.98,43.23) 72.21,43.23 80.11,51.13 80.11,58.01 77.8,60.33 v3(74.8,60.33)
  Bottom Layer w0.254: SW4.1 73.79,61.34 v3(74.8,60.33) ; 67.86,37.21 71.98,41.34 v3(71.98,43.23)
$D7_2: length 28.2
  Top Layer w0.254: v3(90.75,55.27) 90.75,58.39 v3(90.73,58.39)
  Bottom Layer w0.254: 86.91,37.21 87.12,37.21 91.03,41.12 91.03,44.09 91.69,44.75 91.69,46.18 90.75,47.12 v3(90.75,55.27) ; v3(90.73,58.39) 90.73,59.74 92.84,61.85 SW5.1
$D8_2: length 10.7
  Bottom Layer w0.254: SW6.1 16.64,40.6 10.71,34.67
$D9_2: length 11.5
  Bottom Layer w0.254: 29.76,34.67 29.97,34.67 34.59,39.29 34.59,42.93 SW7.1
$D10_2: length 11.4
  Bottom Layer w0.254: SW8.1 54.74,42.7 51,38.96 51,36.14 49.96,35.1 48.81,35.1 48.81,34.67
$D11_2: length 11.3
  Bottom Layer w0.254: SW9.1 72.72,42.93 72.72,41.43 68.88,37.59 68.88,35.7 67.86,34.67
$D12_2: length 10.7
  Bottom Layer w0.254: SW10.1 92.84,40.6 86.91,34.67
$D13_2: length 8.3
  Bottom Layer w0.254: SW11.1 16.42,23.88 10.71,18.16
$D14_2: length 8.3
  Bottom Layer w0.254: 29.76,18.16 29.92,18.16 35.64,23.88 SW12.1
$D15_2: length 8.3
  Bottom Layer w0.254: SW13.1 49.02,18.16 48.81,18.16
$D16_2: length 8.3
  Bottom Layer w0.254: 67.86,18.16 68,18.16 73.71,23.88 SW14.1
$D17_2: length 8.4
  Bottom Layer w0.254: 86.93,18.24 87.27,18.24 92.91,23.88 SW15.1
$D18_2: length 14.2
  Top Layer w0.254: v3(15.8,6.65) 15.8,11.63 v3(11.89,15.54)
  Bottom Layer w0.254: SW16.1 16.08,4.83 15.8,5.11 v3(15.8,6.65) ; 10.71,15.62 11.81,15.62 v3(11.89,15.54)
$D19_2: length 13.8
  Top Layer w0.254: v3(31.06,15.21) 35.1,11.18 v3(35.1,7.09)
  Bottom Layer w0.254: SW17.1 35.1,5.41 v3(35.1,7.09)
  Bottom Layer w0.381: v3(31.06,15.21) 30.66,15.62 29.76,15.62
$D20_2: length 13.8
  Top Layer w0.254: v3(53.85,6.68) 53.85,11.53 v3(50.14,15.24)
  Bottom Layer w0.254: SW18.1 53.85,5.72 v3(53.85,6.68)
  Bottom Layer w0.381: 48.81,15.62 49.76,15.62 v3(50.14,15.24)
$D21_2: length 13.8
  Top Layer w0.254: v3(69.14,15.29) 73.13,11.3 v3(73.13,6.71)
  Bottom Layer w0.254: SW19.1 73.13,5.49 v3(73.13,6.71)
  Bottom Layer w0.381: 67.86,15.62 68.81,15.62 v3(69.14,15.29)
$D22_2: length 15.1
  Top Layer w0.254: v3(91.75,6.78) 91.75,9.79 85.92,15.62 v3(85.67,15.62)
  Bottom Layer w0.254: SW20.1 91.75,5.92 v3(91.75,6.78)
  Bottom Layer w0.381: v3(85.67,15.62) 86.91,15.62
$FUSE1_1: length 14.2
  Bottom Layer w0.508: USB1.1 55.32,65.67 52.91,63.26 52.91,55.59 51.38,54.06
$J1_2: length 5.4
  Bottom Layer w0.508: J1.2 2.25,13.05 6.28,13.05
$KEY1_3: length 29.5
  Top Layer w0.254: v3(75.29,47.22) 75.41,47.22 78.54,50.34 78.54,55.07 78,55.6 v3(76.45,55.6)
  Bottom Layer w0.254: 72.39,37.79 76.61,37.8 ; 76.61,37.8 76.61,37.79 78.99,37.79 ; 76.61,37.8 76.61,45.38 75.29,46.7 v3(75.29,47.22) ; v3(76.45,55.6) 76.44,55.61 U1.44
$U8_2: length 14.2
  Bottom Layer w0.254: 82.48,13.05 81.65,12.22 70,12.22 69.03,11.25
$U10_2: length 14.2
  Bottom Layer w0.254: 44.38,13.05 43.55,12.22 31.9,12.22 30.93,11.25
$U10_4: length 14.2
  Bottom Layer w0.254: 63.43,13.05 62.6,12.22 50.95,12.22 49.98,11.25
$U11_2: length 14.2
  Bottom Layer w0.254: 11.88,11.25 12.82,12.19 24.47,12.19 25.33,13.05
COL1: length 85.2
  Top Layer w0.254: NOREF#21.1 2.87,68.33 6.22,64.97 6.22,63.75 12.47,57.51 62.26,57.51 67.23,52.53 v4(74.6,52.53)
  Bottom Layer w0.254: v4(74.6,52.53) 75.94,51.19 75.94,48.48
COL2: length 83.7
  Top Layer w0.254: v4(74.12,51.92) 67.21,51.92 62.08,57.05 12.24,57.05 5.74,63.55 5.74,64.8 4.24,66.29 NOREF#20.2
  Bottom Layer w0.254: 75.44,48.48 75.44,50.95 74.47,51.92 v4(74.12,51.92)
COL3: length 81.4
  Top Layer w0.254: NOREF#26.3 2.13,64.26 3.25,63.14 5.46,63.14 12.01,56.59 61.9,56.59 67.31,51.18 v3(74.35,51.18)
  Bottom Layer w0.254: v3(74.35,51.18) 74.94,50.58 74.94,48.48
COL4: length 82.8
  Top Layer w0.254: NOREF#3.4 61.7,56.13 67.26,50.57 74.68,50.57 75.18,51.08 75.18,53.42 v3(74.75,53.85)
  Bottom Layer w0.254: U1.39 73.94,56.08 74.75,55.27 v3(74.75,53.85)
COL5: length 84.3
  Top Layer w0.254: NOREF#7.1 2.9,55.73 61.47,55.73 67.08,50.11 74.83,50.11 75.72,51 75.72,53.8 v3(75.67,53.85)
  Bottom Layer w0.254: v3(75.67,53.85) 75.67,55.02 74.44,56.24 74.44,56.98
COL6: length 136.8
  Top Layer w0.254: NOREF#9.2 4.5,48.84 53.8,48.84 58.62,44.02 64.11,44.02 67.13,41 70.69,41 87.05,57.35 87.05,63.09 92.28,68.33 NOREF#2.2
  Bottom Layer w0.254: NOREF#2.2 92.15,68.33 91.52,67.69 80.29,67.69 75.46,62.87 75.46,58.7 74.94,58.18 74.94,56.98
COL7: length 133.6
  Top Layer w0.254: NOREF#15.3 91.67,65.02 91.67,61.34 70.89,40.56 66.95,40.56 63.96,43.56 58.34,43.56 53.49,48.41 3.4,48.41 1.78,50.04 NOREF#17.3
  Bottom Layer w0.254: 75.44,56.98 75.44,57.97 75.89,58.42 75.89,62.64 80.49,67.23 91.54,67.23 92.48,66.29 NOREF#15.3
COL8: length 131.5
  Top Layer w0.254: NOREF#4.4 53.21,48.01 58.12,43.1 63.78,43.1 66.75,40.13 71.04,40.13 92.94,62.03 NOREF#23.4
  Bottom Layer w0.254: U1.43 75.94,57.78 76.33,58.17 76.33,62.48 80.64,66.8 90.65,66.8 92.94,64.52 NOREF#23.4
COL9: length 127.2
  Top Layer w0.254: NOREF#16.1 89.89,53.09 84.61,53.09 69.82,38.3 5.87,38.3 1.27,42.9 NOREF#5.1
  Bottom Layer w0.254: U1.45 76.94,57.78 76.78,57.94 76.78,60.93 77.62,61.77 85.9,61.77 90.98,56.69 92.94,56.69 NOREF#16.1
COL10: length 121.2
  Top Layer w0.254: NOREF#27.2 91.39,52.55 84.66,52.55 69.95,37.85 NOREF#11.2
  Bottom Layer w0.254: NOREF#27.2 85.67,61.37 77.85,61.37 77.27,60.78 77.27,58.04 77.44,57.86 U1.46
COL11: length 161.8
  Top Layer w0.254: NOREF#10.3 84.81,52.07 76,43.26 v3(76,43) 75.87,43 70.21,37.34 2.67,37.34 v3(2.67,37.19) 2.67,19.56 v3(2.64,19.53) v3(2.64,4.67)
  Bottom Layer w0.254: 74.44,48.48 74.44,45.83 76,44.27 v3(76,43) ; SW11.2 2.67,19.56 v3(2.64,19.53) ; v3(2.67,37.19) SW6.2 SW1.2 ; v3(2.64,4.67) 2.64,2.31 SW16.2
COL12: length 171.6
  Top Layer w0.254: v3(21.72,4.22) v3(21.72,23.42) 21.72,27.53 28.96,34.77 v3(69.57,34.77) 82.83,34.77 87.15,39.09 87.15,44.25 NOREF#13.1
  Bottom Layer w0.254: SW12.2 v3(21.72,23.42) 21.72,27.53 27.56,33.38 27.56,37.95 27.07,38.44 23.66,38.44 SW7.2 SW2.2 ; SW17.2 v3(21.72,4.22) ; 73.94,48.48 73.94,45.74 75.39,44.3 75.39,41.53 75.01,41.15 73.13,41.15 69.57,37.59 v3(69.57,34.77)
COL13: length 151
  Top Layer w0.254: v3(40.77,4.42) 40.74,4.45 v3(40.74,23.42) 40.74,27.2 47.7,34.16 v3(61.9,34.16) 83.01,34.16 91.69,42.85 91.69,46.76 NOREF#25.2
  Bottom Layer w0.254: v3(40.77,4.42) 40.77,2.26 ; SW3.2 SW8.2 SW13.2 40.74,21.36 v3(40.74,23.42) ; v3(61.9,34.16) 61.75,34.32 61.75,41.73 63.37,43.36 63.37,46.86 66.49,49.98 71.44,49.98
COL14: length 117.5
  Top Layer w0.254: v3(63.98,50.47) 63.98,52.25 v3(61.19,55.04) ; v3(59.82,4.47) v3(59.82,23.24) 59.82,27.2 66.32,33.71 83.24,33.71 92.94,43.41 NOREF.3
  Bottom Layer w0.254: SW14.2 v3(59.82,23.24) 59.82,31.9 61.21,33.3 61.21,38.99 SW9.2 62.94,43.51 62.94,47.19 63.98,48.23 v3(63.98,50.47) 71.44,50.47 71.44,50.48 ; SW4.2 61.19,58.06 v3(61.19,55.04) ; v3(59.82,4.47) SW19.2
COL15: length 119.8
  Top Layer w0.254: NOREF#22.2 88.19,37.85 78.87,28.52 v3(78.87,23.39) v3(78.87,4.52) ; v3(79.4,57.66) 75.67,57.66 72.67,54.66 v3(72.67,53.19)
  Bottom Layer w0.254: SW5.2 79.4,58.9 v3(79.4,57.66) 79.63,57.43 84.96,57.43 87.63,54.76 87.63,44.27 85.67,42.32 85.67,34.24 86.21,33.71 88.16,33.71 92.3,37.85 NOREF#22.2 ; v3(72.67,53.19) 72.54,53.19 72.54,51.21 72.32,50.98 71.44,50.98 ; v3(78.87,4.52) SW20.2 ; SW15.2 v3(78.87,23.39) 78.87,32 80.37,33.5 80.37,38.33 79.93,38.76 79.93,40.39 SW10.2
D+: length 10.7
  Bottom Layer w0.254: 61.54,52.06 62.87,53.39 69.26,53.39 69.85,53.98 71.44,53.98
D-: length 14.5
  Bottom Layer w0.254: 71.44,53.48 70.04,53.48 69.54,52.98 63.22,52.98 62.84,52.6 62.84,51.49 62.4,51.04 59.97,51.04 59,52.01
NRGB: length 73.6
  Top Layer w0.254: J2.2 90.3,12.19 84.71,17.78 v3(79.65,17.78)
  Bottom Layer w0.254: v3(79.65,17.78) 79.22,17.78 77.06,19.94 77.06,24.21 68.17,33.1 67,33.1 66.34,33.76 66.34,41.78 63.81,44.32 63.81,46.61 66.7,49.51 72.37,49.51 72.95,50.09 72.95,52.53 73.28,52.86 73.28,53.47 72.27,54.48 71.44,54.48
  Bottom Layer w0.508: 88.08,11.25 92.02,11.25 J2.2
ROW1: length 122
  Top Layer w0.254: v5(82.8,36.3) 82.5,35.99 v4(63.73,35.99) v4(44.09,35.99) 25.43,35.99 v3(25.37,35.94)
  Bottom Layer w0.254: NOREF#8.1 5.93,35.81 7.33,37.21 7.87,37.21 7.87,35.79 9.91,33.76 23.19,33.76 v3(25.37,35.94) ; v5(82.8,36.3) 83.52,37.02 83.52,37.21 ; 83.52,37.21 85.14,38.84 85.14,41.81 82.63,44.32 82.63,49.38 81.02,50.98 U1.10 ; 83.52,37.21 85.17,35.57 85.17,34.01 85.95,33.22 90.35,33.22 NOREF#12.1
  Bottom Layer w0.381: v3(25.37,35.94) 26.37,36.94 26.37,37.21 ; 45.42,37.21 45.31,37.21 v4(44.09,35.99) ; v4(63.73,35.99) 63.73,36.47 64.47,37.21
ROW2: length 117.9
  Top Layer w0.254: v3(25.35,34.67) 26.09,35.41 v4(46.33,35.41) v4(62.99,35.41) v4(82.17,35.41)
  Bottom Layer w0.254: NOREF#14.2 91.8,32.64 85.56,32.64 83.52,34.67 ; v3(25.35,34.67) 23.98,33.3 8.7,33.3 7.33,34.67 6.44,33.78 NOREF#19.2 ; v4(82.17,35.41) 82.17,37.64 82.91,38.38 83.29,38.38 84.66,39.75 84.66,41.53 82.19,43.99 82.19,49 80.71,50.48 U1.11
  Bottom Layer w0.381: 64.47,34.67 64.08,34.67 63.35,35.41 v4(62.99,35.41) ; v3(25.35,34.67) 26.37,34.67 ; v4(82.17,35.41) 82.91,34.67 83.52,34.67 ; v4(46.33,35.41) 45.59,34.67 45.42,34.67
ROW3: length 141.3
  Bottom Layer w0.254: NOREF#6.3 92.58,32.11 84.23,32.11 81.33,35 81.33,38.91 80.82,39.42 80.82,42.95 81.71,43.84 81.71,48.49 80.22,49.98 U1.12 ; NOREF#24.3 1.27,31.7 2.46,30.51 2.46,25.37 4.65,23.19 4.65,20.55 6.63,18.57 7.33,18.57 7.33,18.13 8.2,17.25 25.46,17.25 26.37,18.16 27.44,17.09 44.36,17.09 45.42,18.16 46.57,17.02 63.33,17.02 64.47,18.16 65.51,17.12 82.41,17.12 86.82,21.53 86.82,24.49 87.91,25.58 87.91,32.11
ROW4: length 144.7
  Top Layer w0.254: v3(84.3,31.47) 91.19,31.47 NOREF#18.4
  Bottom Layer w0.254: 26.37,15.62 25.36,16.64 8.31,16.64 7.33,15.66 7.33,15.62 4.22,18.73 4.22,22.96 1.27,25.91 NOREF#28.4 ; v3(84.3,31.47) 84.12,31.47 80.82,34.77 80.82,38.66 80.42,39.07 80.42,41.81 77.32,44.91 77.32,46.56 78.44,47.68 78.44,48.48 ; 26.38,15.62 27.26,16.51 44.65,16.51 45.43,15.74 45.43,15.62 46.31,16.51 63.59,16.51 64.48,15.62 65.44,16.59 82.56,16.59 83.52,15.62 85.22,17.32 85.22,18.47 86.16,19.41 87.68,19.41 91.01,22.73 91.01,25.1 92.94,27.03 NOREF#18.4

## Copper pours and planes (outline as drawn; the poured copper is in the pictures)
GND on Top Layer: 94.26,72.02 94.26,0 0,0 0,72.02
GND on Bottom Layer: 94.26,72.02 94.26,0 0,0 0,72.02

Small or netless copper shapes (teardrops, artwork), in the pictures only: 72 on Top Layer, 58 on Bottom Layer

## Text on the board
Bottom Silkscreen Layer: RESET | BOOT
